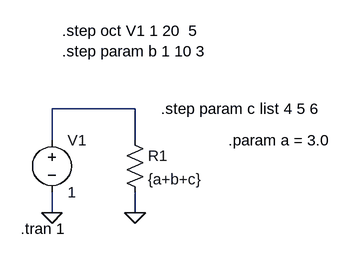
[diagram p0: schematic test12.asc]
test12.asc, the LTspice schematic file:
Version 4
SHEET 1 880 680
WIRE 208 96 80 96
WIRE 80 144 80 96
WIRE 208 144 208 96
WIRE 80 256 80 224
WIRE 208 256 208 224
FLAG 80 256 0
FLAG 208 256 0
SYMBOL voltage 80 128 R0
SYMATTR InstName V1
SYMATTR Value 1
SYMBOL res 192 128 R0
SYMATTR InstName R1
SYMATTR Value {a+b+c}
TEXT 96 -24 Left 2 !.step oct V1 1 20  5\n.step param b 1 10 3
TEXT 32 280 Left 2 !.tran 1
TEXT 248 96 Left 2 !.step param c list 4 5 6
TEXT 352 144 Left 2 !.param a = 3.0

The netlist it stands for:
* test12.asc
V1 N001 0 1
R1 N001 0 {a+b+c}
.step oct V1 1 20  5
.step param b 1 10 3
.tran 1
.step param c list 4 5 6
.param a = 3.0
.backanno
.end